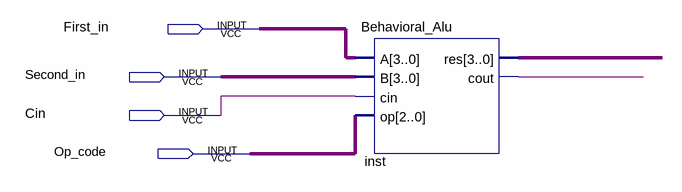
[diagram p0: schematic sheet]
// Quartus schematic TheFinal_step.bdf as structural Verilog: 1 symbols, 4 pins
module TheFinal_step (
  input  First_in,
  input  Second_in,
  input  Cin,
  input  Op_code
);

  wire inst_cout;
  wire [2:0] undriven_3;
  wire [3:0] inst_res, undriven, undriven_2;

  Behavioral_Alu inst (.A(undriven), .B(undriven_2), .cin(Cin), .op(undriven_3), .res(inst_res), .cout(inst_cout));
endmodule
